# Altium schematic sheet LT3762.SchDoc
size A3
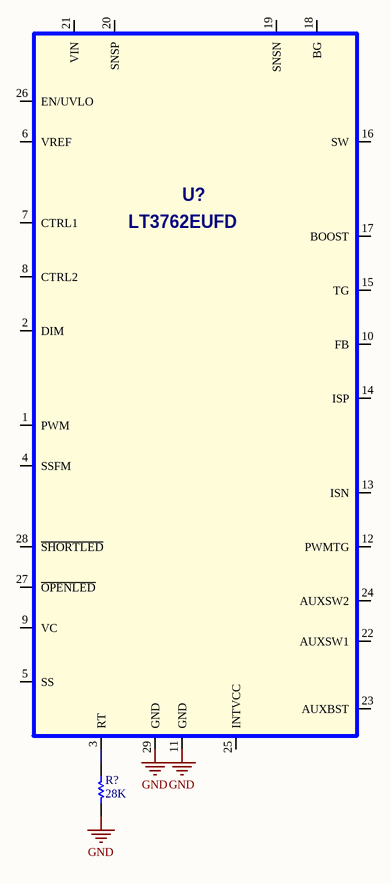
[diagram p0: LT3762.SchDoc]

## Parts
R?  28K  [R0603]
U?  LT3762EUFD  [QFN-28_L5.0-W4.0-P0.50-BL-EP]

## Nets
GND: R?.2 U?.11(GND) U?.29(GND)
NetR?_1: R?.1 U?.3(RT)

Not connected (* = marked no-connect by the designer): U? 1(PWM) 2(DIM) 4(SSFM) 5(SS) 6(VREF) 7(CTRL1) 8(CTRL2) 9(VC) 10(FB) 12(PWMTG) 13(ISN) 14(ISP) 15(TG) 16(SW) 17(BOOST) 18(BG) 19(SNSN) 20(SNSP) 21(VIN) 22(AUXSW1) 23(AUXBST) 24(AUXSW2) 25(INTVCC) 26(EN/UVLO) 27(~{OPENLED}) 28(~{SHORTLED})

## Library data of the parts
R? = Res1: Value: 1K; Published: 8-Jun-2000; Revision: July-2002: Re-released for DXP Platform.; Publisher: Altium Limited
U? = LT3932EFE_37: Part Reference: U1; PCB Footprint: QFN-28-4X5; Value: LT3762EUFD